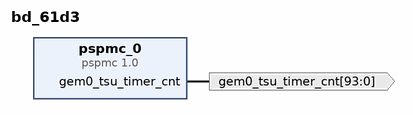
[diagram p0: block diagram of the top level]
# Vivado block design bd_61d3, xcvc1902-vsva2197-2MP-e-S, Vivado 2021.1
create_bd_design bd_61d3

create_bd_port -dir O -from 93 -to 0 gem0_tsu_timer_cnt

create_bd_cell -type ip -vlnv xilinx.com:ip:pspmc:1.0 pspmc_0
